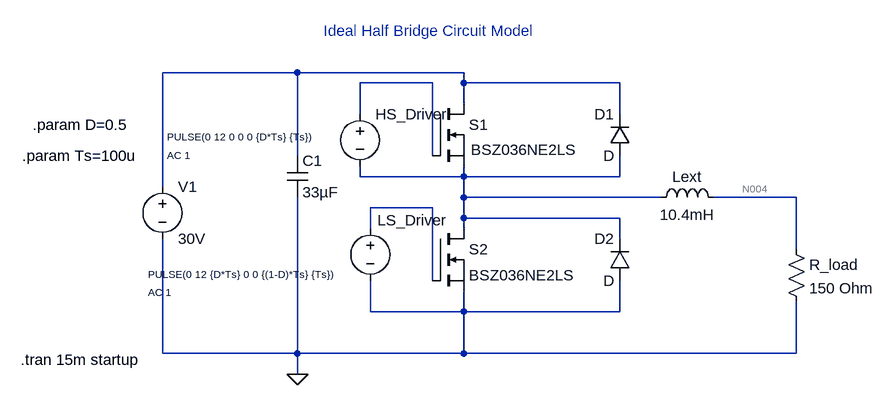
[diagram p0: schematic IdealHalfBridgeCircuitModel.asc]
IdealHalfBridgeCircuitModel.asc, the LTspice schematic file:
Version 4
SHEET 1 944 680
WIRE 48 -16 -160 -16
WIRE 304 -16 48 -16
WIRE 256 0 144 0
WIRE 304 0 304 -16
WIRE 544 0 304 0
WIRE 304 32 304 0
WIRE 144 48 144 0
WIRE 544 48 544 0
WIRE 48 112 48 -16
WIRE 256 112 256 0
WIRE 144 144 144 128
WIRE 304 144 304 128
WIRE 304 144 144 144
WIRE 544 144 544 112
WIRE 544 144 304 144
WIRE -160 160 -160 -16
WIRE 304 176 304 144
WIRE 608 176 304 176
WIRE 816 176 688 176
WIRE 256 192 160 192
WIRE 304 208 304 176
WIRE 544 208 304 208
WIRE 160 224 160 192
WIRE 304 224 304 208
WIRE 544 240 544 208
WIRE 816 256 816 176
WIRE 256 304 256 192
WIRE 160 352 160 304
WIRE 304 352 304 320
WIRE 304 352 160 352
WIRE 544 352 544 304
WIRE 544 352 304 352
WIRE -160 416 -160 240
WIRE 48 416 48 176
WIRE 48 416 -160 416
WIRE 304 416 304 352
WIRE 304 416 48 416
WIRE 816 416 816 336
WIRE 816 416 304 416
WIRE 48 448 48 416
FLAG 48 448 0
SYMBOL cap 32 112 R0
SYMATTR InstName C1
SYMATTR Value 33µF
SYMBOL nmos 256 32 R0
WINDOW 3 59 71 Left 2
SYMATTR InstName S1
SYMATTR Value BSZ036NE2LS
SYMBOL nmos 256 224 R0
SYMATTR InstName S2
SYMATTR Value BSZ036NE2LS
SYMBOL diode 560 112 R180
WINDOW 0 24 64 Left 2
WINDOW 3 24 0 Left 2
SYMATTR InstName D1
SYMBOL diode 560 304 R180
WINDOW 0 24 64 Left 2
WINDOW 3 24 0 Left 2
SYMATTR InstName D2
SYMBOL ind 592 192 R270
WINDOW 0 32 56 VTop 2
WINDOW 3 5 56 VBottom 2
SYMATTR InstName Lext
SYMATTR Value 10.4mH
SYMBOL res 800 240 R0
SYMATTR InstName R_load
SYMATTR Value 150 Ohm
SYMBOL voltage -160 144 R0
WINDOW 123 0 0 Left 0
WINDOW 39 0 0 Left 0
SYMATTR InstName V1
SYMATTR Value 30V
SYMBOL voltage 144 32 R0
WINDOW 3 -297 51 Left 1
WINDOW 123 -297 79 Left 1
WINDOW 39 0 0 Left 0
SYMATTR InstName HS_Driver
SYMATTR Value PULSE(0 12 0 0 0 {D*Ts} {Ts})
SYMATTR Value2 AC 1
SYMBOL voltage 160 208 R0
WINDOW 0 11 3 Left 2
WINDOW 3 -342 86 Left 1
WINDOW 123 -342 114 Left 1
WINDOW 39 0 0 Left 0
SYMATTR InstName LS_Driver
SYMATTR Value PULSE(0 12 {D*Ts} 0 0 {(1-D)*Ts} {Ts})
SYMATTR Value2 AC 1
TEXT 88 -80 Left 2 ;Ideal Half Bridge Circuit Model
TEXT -360 64 Left 2 !.param D=0.5
TEXT -376 112 Left 2 !.param Ts=100u
TEXT -378 426 Left 2 !.tran 15m startup

The netlist it stands for:
* IdealHalfBridgeCircuitModel.asc
C1 N001 0 33µF
M§S1 N001 N002 N003 N003 BSZ036NE2LS
M§S2 N003 N005 0 0 BSZ036NE2LS
D1 N003 N001 D
D2 0 N003 D
Lext N003 N004 10.4mH
R_load N004 0 150 Ohm
V1 N001 0 30V
V§HS_Driver N002 N003 PULSE(0 12 0 0 0 {D*Ts} {Ts}) AC 1
V§LS_Driver N005 0 PULSE(0 12 {D*Ts} 0 0 {(1-D)*Ts} {Ts}) AC 1
.model D D
.lib standard.dio
.model NMOS NMOS
.model PMOS PMOS
.lib standard.mos
* Ideal Half Bridge Circuit Model
.param D=0.5
.param Ts=100u
.tran 15m startup
.backanno
.end

* Results of the author's LTspice run, read from the files saved beside the schematic
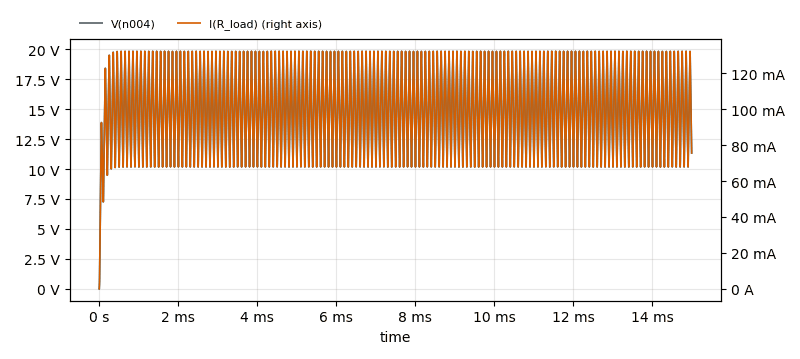
[diagram p1: Transient Analysis of IdealHalfBridgeCircuitModel.asc, plotted from the saved traces]
* Transient Analysis, 1 run:
*   V(n004): min 0 V, max 19.83 V, average 14.94 V, rms 15.31 V, last 10.55 V
*   I(R_load): min 0 A, max 132.2 mA, average 99.6 mA, rms 102.1 mA, last 70.32 mA